# EAGLE design Enclosure 85x58 BCS-A4a (EAGLE 9.6.2)
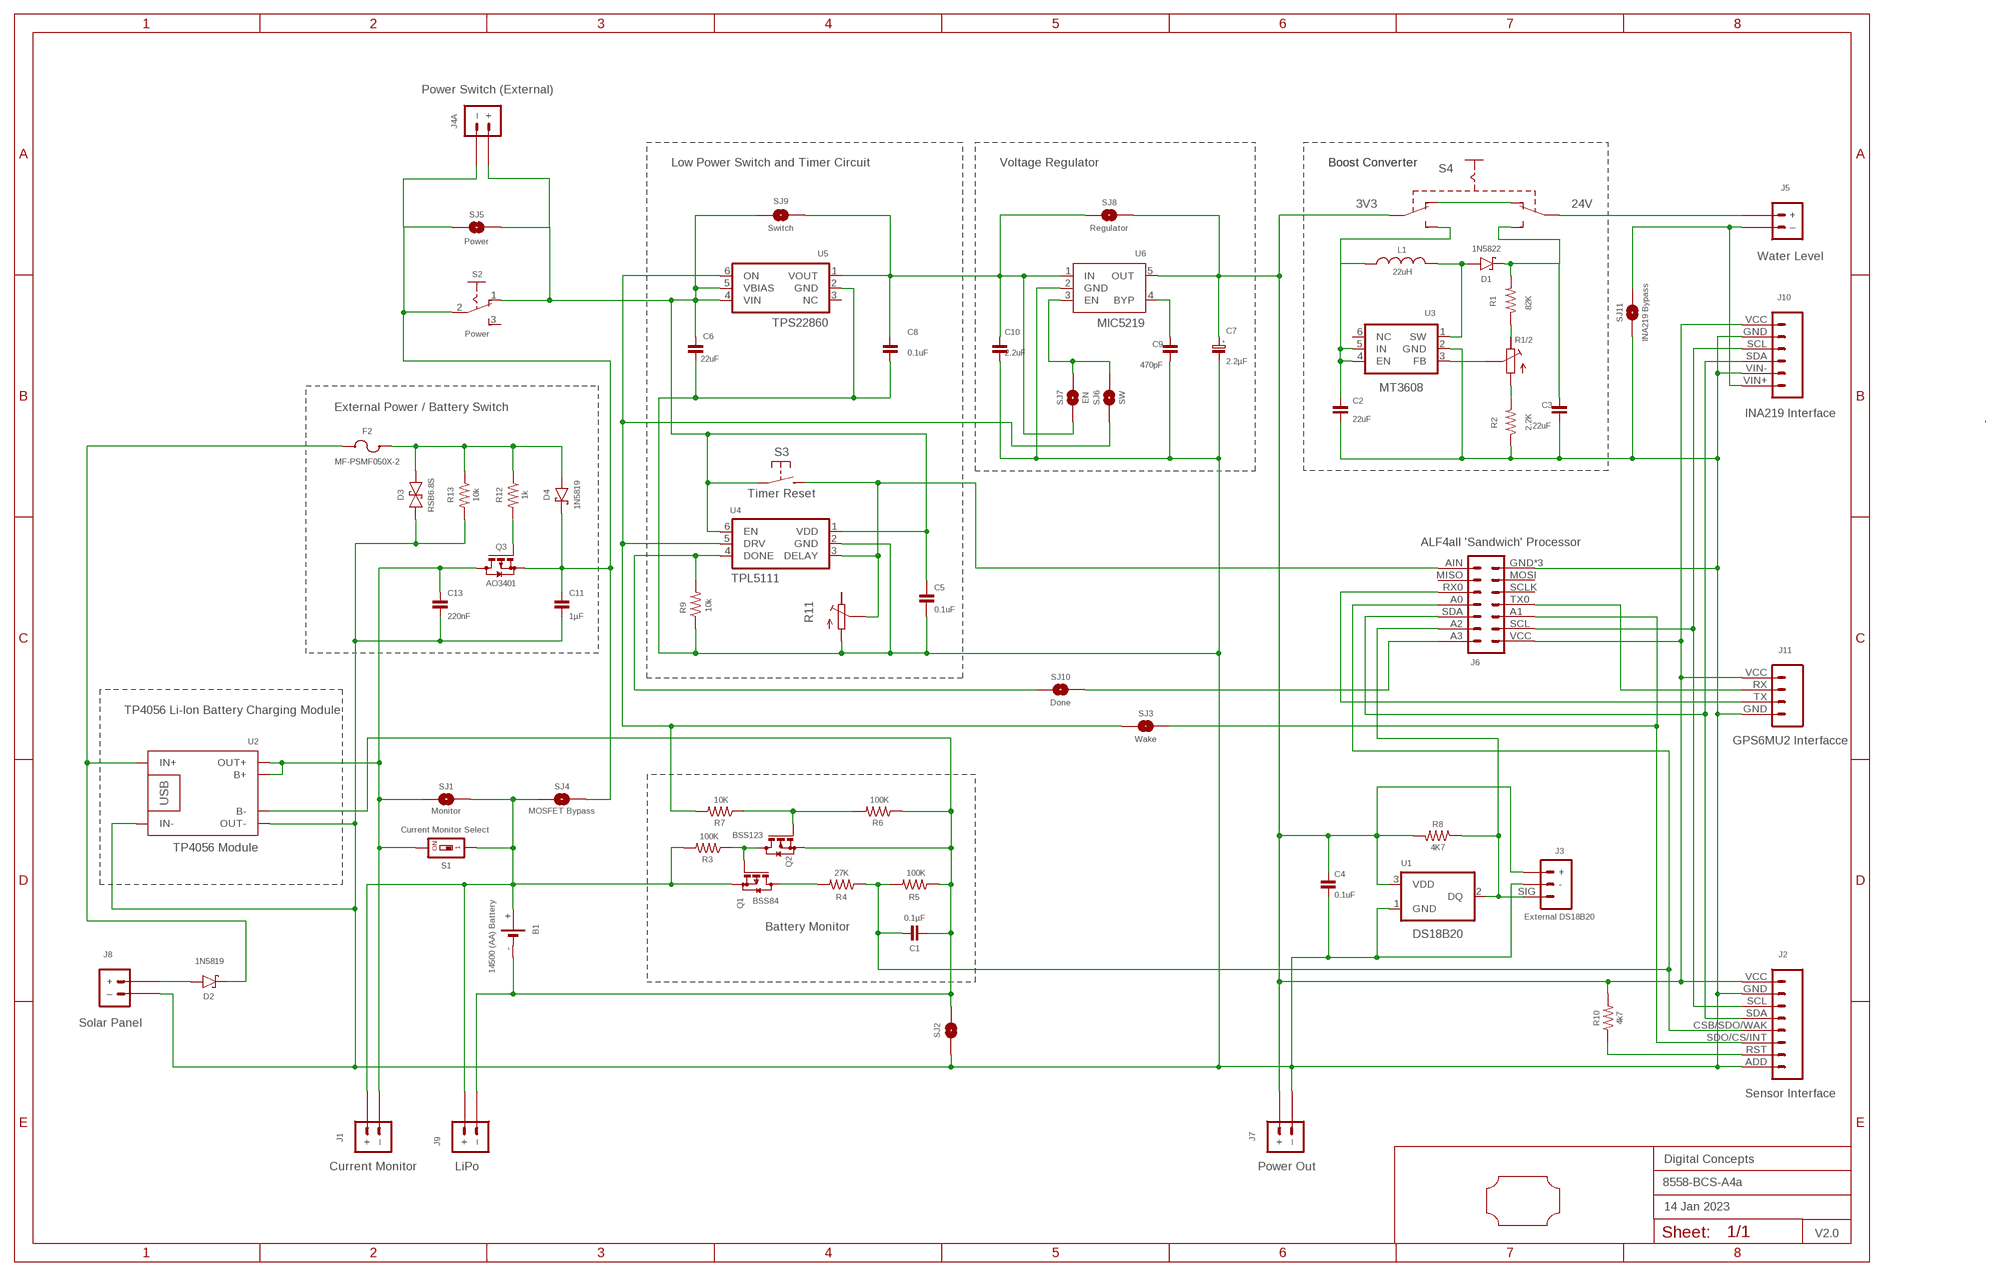
[diagram p0: schematic, sheet 1]
FRAME2 (A3L-LOC): DATE: 14 Jan 2023; OWNER: Digital Concepts; TITLE: 8558-BCS-A4a; VERSION: V2.0

## Parts
B1  14500 (AA) Battery  BATTERY-HOLDER-14500(AA)  [BATTERY-14500]
C1  0.1µF  CAPACITOR-0805  [C0805]
C2  22uF  CAPACITOR-1206  [C1206]
C3  22uF  CAPACITOR-1206  [C1206]
C4  0.1uF  CAPACITOR-0805  [C0805]
C5  0.1uF  CAPACITOR  [C0805@1]
C6  22uF  CAPACITOR-1206  [C1206]
C7  2.2µF  CAPACITOR-1206-TANTALUM  [C1206-POLARISED]
C8  0.1uF  CAPACITOR-0805  [C0805]
C9  470pF  CAPACITOR-0805  [C0805]
C10  2.2uF  CAPACITOR-0805  [C0805]
C11  1µF  CAPACITOR-0805  [C0805]
C13  220nF  CAPACITOR-0805  [C0805]
D1  1N5822  DIODE-SCHOTTKY-1N5822  [DIODE_SMB]
D2  1N5819  1N5819-SOD-123  [SOD-123]
D3  RSB6.8S  DIODE-SCHOTTKY-BIDIRECTIONAL  [VMD2]
D4  1N5819  DIODE-SCHOTTKY-1N5819  [SOD-123]
F2  MF-PSMF050X-2  [F0805]
J1  Current Monitor  JST-PH2.0-2-H-POWER  [JST-PH2.0-2-HORIZONTAL-POWER]
J2  Sensor Interface  HEADER-1X8-SENSOR  [CONN_08-SENSOR]
J3  External DS18B20  JST-PH2.0-3-VERTICAL-SIG  [JST-PH2.0-3-VERTICAL-SIG]
J4A  Power Switch (External)  JST-PH2.0-2-DUAL-POWER"  [JST-PH2.0-2-DUAL-POWER]
J5  Water Level  JST-PH2.0-2-VERTICAL-POWER  [JST-PH2.0-2-VERTICAL-POWER]
J6  ALF4all 'Sandwich' Processor  ALF4ALL-PROCESSOR-BOARD  [ALF4ALL-PROCESSOR-BOARD]
J7  Power Out  JST-GH1.25-2-VERTICAL-POWER  [JST-GH1.25-2-VERTICAL-POWER]
J8  Solar Panel  JST-PH2.0-2-VERTICAL-POWER  [JST-PH2.0-2-VERTICAL-POWER]
J9  LiPo  JST-PH2.0-2-H-POWER  [JST-PH2.0-2-HORIZONTAL-POWER]
J10  INA219 Interface  INA219-I2C-MODULE  [CONN_06-INA219]
J11  GPS6MU2 Interfacce  HEADER-1X4-GPS  [CONN_04-GPS]
L1  22uH  INDUCTOR-CDRH104R/6D28L5038P  [CDRH104R+6D28]
Q1  BSS84  [SOT23]
Q2  BSS123  [SOT23]
Q3  AO3401  MOSFET-AO3401  [SOT-23]
R1  82K  RESISTORR0805  [R0805]
R1/2  RESISTOR-TRIMM-BAOTER-HORIZONTAL  [RTRIM64P]
R2  2.2K  RESISTOR-VIA-1  [R0805-VIA-1]
R3  100K  RESISTORR0805  [R0805]
R4  27K  RESISTORR0805  [R0805]
R5  100K  RESISTORR0805  [R0805]
R6  100K  RESISTORR0805  [R0805]
R7  10K  RESISTORR0805  [R0805]
R8  4K7  RESISTORR0805  [R0805]
R9  10k  RESISTOR-VIA-2  [R0805-VIA-2]
R10  4k7  RESISTORR0805  [R0805]
R11  RESISTOR-TRIMM-BAOTER-HORIZONTAL  [RTRIM64P]
R12  1k  RESISTORR0805  [R0805]
R13  10k  RESISTORR0805  [R0805]
S1  Current Monitor Select  SWITCH-DIP-SWS001-VIA-1  [SMD-001-VIA-1]
S2  Power  SWITCH-SLIDE-SPDT  [SWITCH-SLIDE-SPDT]
S3  Timer Reset  SWITCH-MOMENTARY-2-PIN  [SWITCH-2-PAD]
S4  SWITCH-SLIDE-DPDT-PTH-S  [SWITCH-DPDT-PTH]
SJ1  Monitor  SJ  [SJ]
SJ2  Charge  SJ-V-1  [SJ-VIA-1]
SJ3  Wake  SJ-V-1  [SJ-VIA-1]
SJ4  MOSFET Bypass  SJ  [SJ]
SJ5  Power  SJ-V-1  [SJ-VIA-1]
SJ6  SW  SJ  [SJ]
SJ7  EN  SJ  [SJ]
SJ8  Regulator  SJ  [SJ]
SJ9  Switch  SJ  [SJ]
SJ10  Done  SJ-V-2  [SJ-VIA-2]
SJ11  INA219 Bypass  SJ  [SJ]
U1  DS18B20  [TO-92]
U2  TP4056 Module  BATTERY-CHARGER-LI-PROT  [BATTERY-CHARGER-LI-PROT]
U3  MT3608  [SOT-23-6]
U4  TPL5111  TPL5111DDCR  [SOT-23-6]
U5  TPS22860  [SOT-23-6]
U6  MIC5219  MIC5219XX  [SOT-23-5]
U$1  PCB-OUTLINE-CA-85X58  [PROTO-28X18-OUTLINE-CA]

## Nets
GND: C2.2 C3.2 C4.2 C5.1 C6.2 C7.2(-) C8.1 C9.2 C10.1 C11.2 C13.2 D3.P$2 J2.ADD J2.GND J3.- J6.GND J6.GND@TL J6.GND@TR J7.-(–) J8.-(–) J10.GND J10.VIN- J11.GND R2.1 R2.1@VIA R9.1 R11.1(A) R13.2 SJ2.1 SJ2.1@V SJ11.1 U1.1(GND) U2.IN- U2.OUT- U3.2(GND) U4.2(GND) U5.2(GND) U6.2(GND)
N$1: D2.A J8.+
N$2: C11.1 D4.C J4A.-(–) Q3.2(S) S2.2(P) SJ4.2 SJ5.2
N$3: B1.+ J1.+ J9.+ Q1.2(S) R3.2 S1.1 S1.1@VIA SJ1.2 SJ4.1
N$5: D2.C F2.1 U2.IN+
N$6: D1.A L1.2 U3.1(SW)
N$7: C9.1 U6.4(BYP)
N$8: J2.SCL J6.SCL J10.SCL
N$9: J2.RST R10.1
N$10: C1.1 J2.CSB/SDO/WAK J6.A0 R4.1 R5.2
N$11: J2.SDA J6.SDA J10.SDA
N$13: J3.SIG J6.A2 R8.1 U1.2(DQ)
N$14: J6.TX0 J11.RX
N$15: J5.-(–) J10.VIN+ SJ11.2
N$16: J6.RX0 J11.TX
N$18: C13.1 J1.-(–) Q3.3(D) S1.2 SJ1.1 U2.B+ U2.OUT+
N$19: SJ6.2 SJ7.2 U6.3(EN)
N$20: C8.2 C10.2 SJ7.1 SJ8.1 SJ9.1 U5.1(VOUT) U6.1(IN)
N$22: J6.A3 SJ10.1
N$23: Q1.3(D) R4.2
N$24: C2.1 L1.1 U3.4(EN) U3.5(IN)
N$25: J6.AIN R11.2(S) S3.P$2(S) U4.3(DELAY)
N$27: C5.2 C6.1 J4A.+ S2.1(O) S3.P$1(P) SJ5.1 SJ5.1@V SJ9.2 U4.1(VDD) U4.6(EN) U5.4(VIN) U5.5(VBIAS)
N$28: R7.2 SJ3.2 SJ6.1 U4.5(DRV) U5.6(ON)
N$29: R9.2 R9.2@VIA SJ10.2 SJ10.2@V U4.4(DONE)
N$30: J2.SDO/CS/INT J6.A1 SJ3.1 SJ3.1@V
N$31: C3.1 D1.C R1.2
N$32: R1.1 R1/2.3(E)
N$33: R1/2.2(S) U3.3(FB)
N$34: R1/2.1(A) R2.2
N$35: Q1.1(G) Q2.3(D) R3.1
N$36: S4.P$6(S2)
N$37: Q2.1(G) R6.2 R7.1
N$38: B1.- C1.2 J9.-(–) Q2.2(S) R5.1 R6.1 SJ2.2 U2.B-
N$39: S4.P$1(O1) S4.P$4(O2)
N$41: S4.P$3(S1)
N$42: J5.+ S4.P$5(P2)
N$43: Q3.1(G) R12.2
N$44: D3.P$1 D4.A F2.2 R12.1 R13.1
VCC: C4.1 C7.1(+) J2.VCC J3.+ J6.VCC J7.+ J10.VCC J11.VCC R8.2 R10.2 S4.P$2(P1) SJ8.2 U1.3(VDD) U6.5(OUT)
Unconnected: J6.MISO J6.MOSI J6.SCLK R11.3(E) S2.3(S) U3.6(NC) U5.3(NC)

## Notes on the sheet
- Low Power Switch and Timer Circuit | Voltage Regulator | Boost Converter | Boost Converter
- 3V3 | 24V
- External Power / Battery Switch
- TP4056 Li-Ion Battery Charging Module
- Battery Monitor

## Library data of the parts
B1 = digitalconcepts:BATTERY-HOLDER-14500(AA): 14500 (AA) battery holder
C1 C4 C8-C11 C13 = digitalconcepts:CAPACITOR-0805: 0805 Capacitor
C2 C3 C6 = digitalconcepts:CAPACITOR-1206: 1206 Capacitor
C5 = digitalconcepts:CAPACITOR: 0805 Capacitor
C7 = digitalconcepts:CAPACITOR-1206-TANTALUM: Capacitor 1206 Tantalum
D1 = digitalconcepts:DIODE-SCHOTTKY-1N5822: 1N5822 Schottky Diode SMB
D2 = digitalconcepts:1N5819-SOD-123: 1N5819 Schottky Diode SOD-123
D3 = digitalconcepts:DIODE-SCHOTTKY-BIDIRECTIONAL: Schottky Bidirectional Diode
D4 = digitalconcepts:DIODE-SCHOTTKY-1N5819: 1N5819 Schottky Diode SOD-123
F2 = digitalconcepts:MF-PSMF050X-2: PTC Resettable Fuse 0.5A/6V 500mA SMD
J1 J9 = digitalconcepts:JST-PH2.0-2-H-POWER: JST PH2.0 2P Right Angle Connector with power pin labelling
J2 = digitalconcepts:HEADER-1X8-SENSOR: IoT Sensors 1x8 Pin Header for 'Sandwich' IoT Sensors
J3 = digitalconcepts:JST-PH2.0-3-VERTICAL-SIG: PH2.0 3P Vertical Connector (Sig)
J4A = digitalconcepts:JST-PH2.0-2-DUAL-POWER: PH2.0 2P PTH Dual-Side Connector (Power); PROD_ID: CONN-09863; SKU: PRT-09914
J5 J8 = digitalconcepts:JST-PH2.0-2-VERTICAL-POWER: JST PH2.0 2P PTH Connector (Power)
J6 = digitalconcepts:ALF4ALL-PROCESSOR-BOARD: ALF4all 'Sandwixh' Processor 2x7 Pin Header and earthed 1x1 locator pins for ALF4all 'Sandwich' Processor/RFM95W PCBs
J7 = digitalconcepts:JST-GH1.25-2-VERTICAL-POWER: JST GH1.25 2P PTH Connector (Power)
J10 = digitalconcepts:INA219-I2C-MODULE: INA219 I2C Module
J11 = digitalconcepts:HEADER-1X4-GPS: NEO GPS 4-Pin Header
L1 = digitalconcepts:INDUCTOR-CDRH104R/6D28: Inductor; SPICEPREFIX: L
Q1 = digitalconcepts:BSS84: P-CHANNEL MOS FET
Q2 = digitalconcepts:BSS123: N-CHANNEL MOS FET
Q3 = digitalconcepts:MOSFET-AO3401: AO3401 P-Channel MOSFET
R1 R3-R8 R10 R12 R13 = digitalconcepts:RESISTOR: Resistor; SPICEPREFIX: R
R1/2 R11 = digitalconcepts:RESISTOR-TRIMM-BAOTER-HORIZONTAL: Trimm Resistor - Horizontal BAOTER
R2 = digitalconcepts:RESISTOR-VIA-1: Resistor with via on Pad 1
R9 = digitalconcepts:RESISTOR-VIA-2: Resistor with via on Pad 2
S1 = digitalconcepts:SWITCH-DIP-SWS001-VIA-1: SMD Dip Switch 1 pol.
S2 = digitalconcepts:SWITCH-SLIDE-SPDT: Mini Sliding Switch SPDT
S3 = digitalconcepts:SWITCH-MOMENTARY-2-PIN: 2 Pin Momentary Switch
S4 = digitalconcepts:SWITCH-SLIDE-DPDT-PTH-S: Switch DPDT PTH-S
SJ1 SJ4 SJ6-SJ9 SJ11 = digitalconcepts:SJ: Solder Jumper
SJ2 SJ3 SJ5 = digitalconcepts:SJ-V-1: Solder Jumper with single Pad Via
SJ10 = digitalconcepts:SJ-V-2: Solder Jumper with Pad Vias
U1 = digitalconcepts:DS18B20: Digital Thermometer -55C-125C TO92-3; AVAILABILITY: Bad; DESCRIPTION: Temperature Sensor Digital, Local -55°C ~ 125°C 12 b 8-uMAX; MF: Maxim Integrated; MP: DS18B20; PACKAGE: TO-92 Maxim Integrated; PRICE: None
U2 = digitalconcepts:BATTERY-CHARGER-LI-PROT: TP4056 Li Battery Charger module with PCB (rather than module) footprint
U3 = digitalconcepts:MT3608: MT3608 DC-DC Step-Up Voltage Converter
U4 = digitalconcepts:TPL5111DDCR: TPL5111 Nano-Power System Timer
U5 = digitalconcepts:TPS22860: Texas Instruments TPS22860 Ultra-Low Leakage Load Switch
U6 = digitalconcepts:MIC5219XX: VOLTAGE REGULATOR; OC_FARNELL: unknown; OC_NEWARK: unknown
U$1 = digitalconcepts:PCB-OUTLINE-CA-85X58: PCB outline with cut-out for 85 x 58 enclosure

## Board
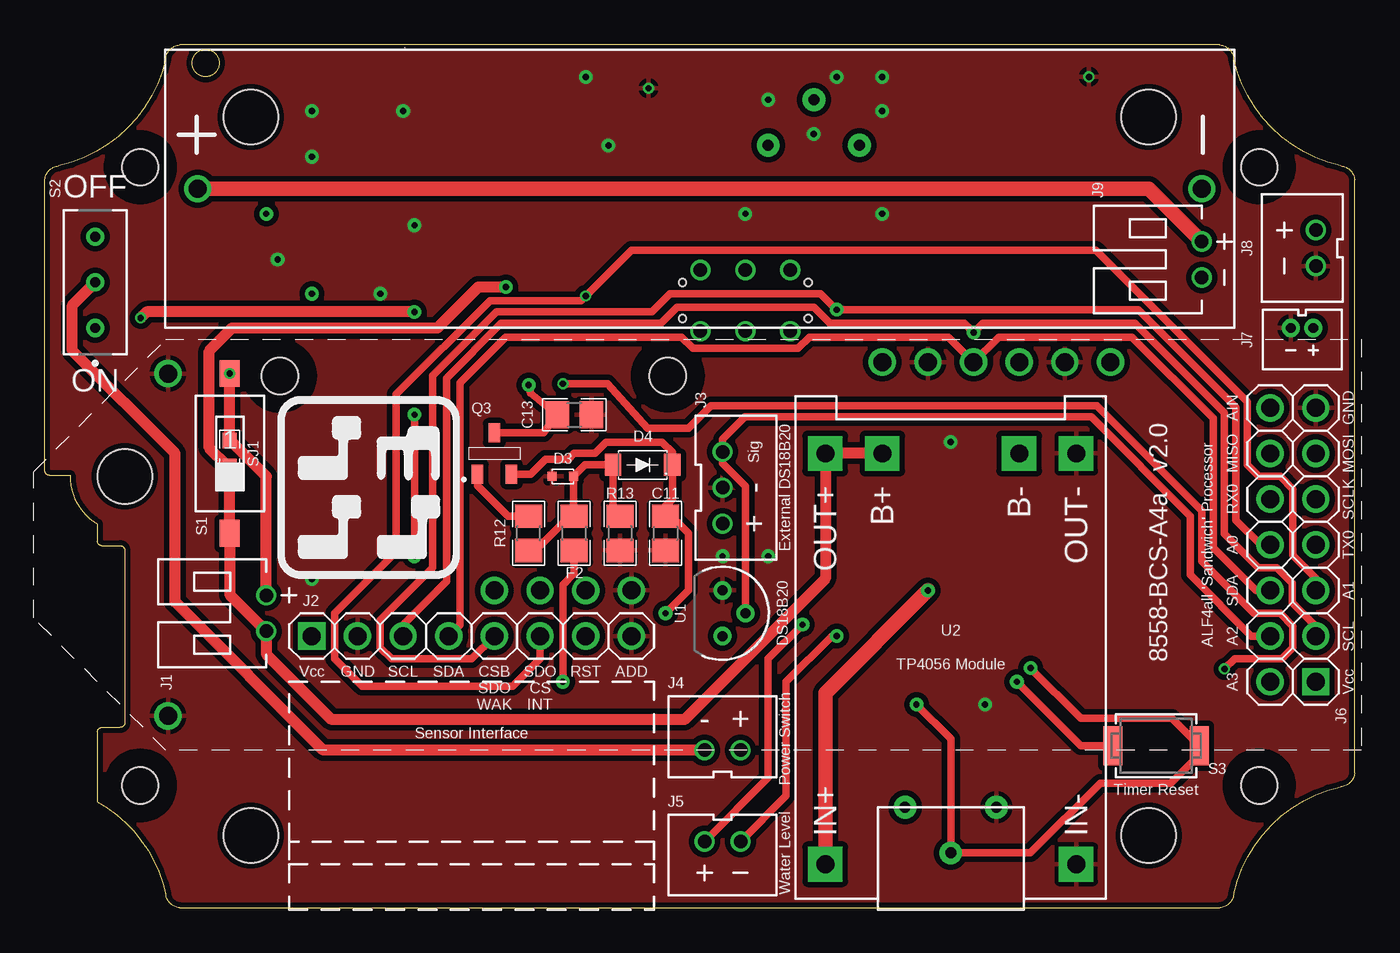
[diagram p1: board, top side]
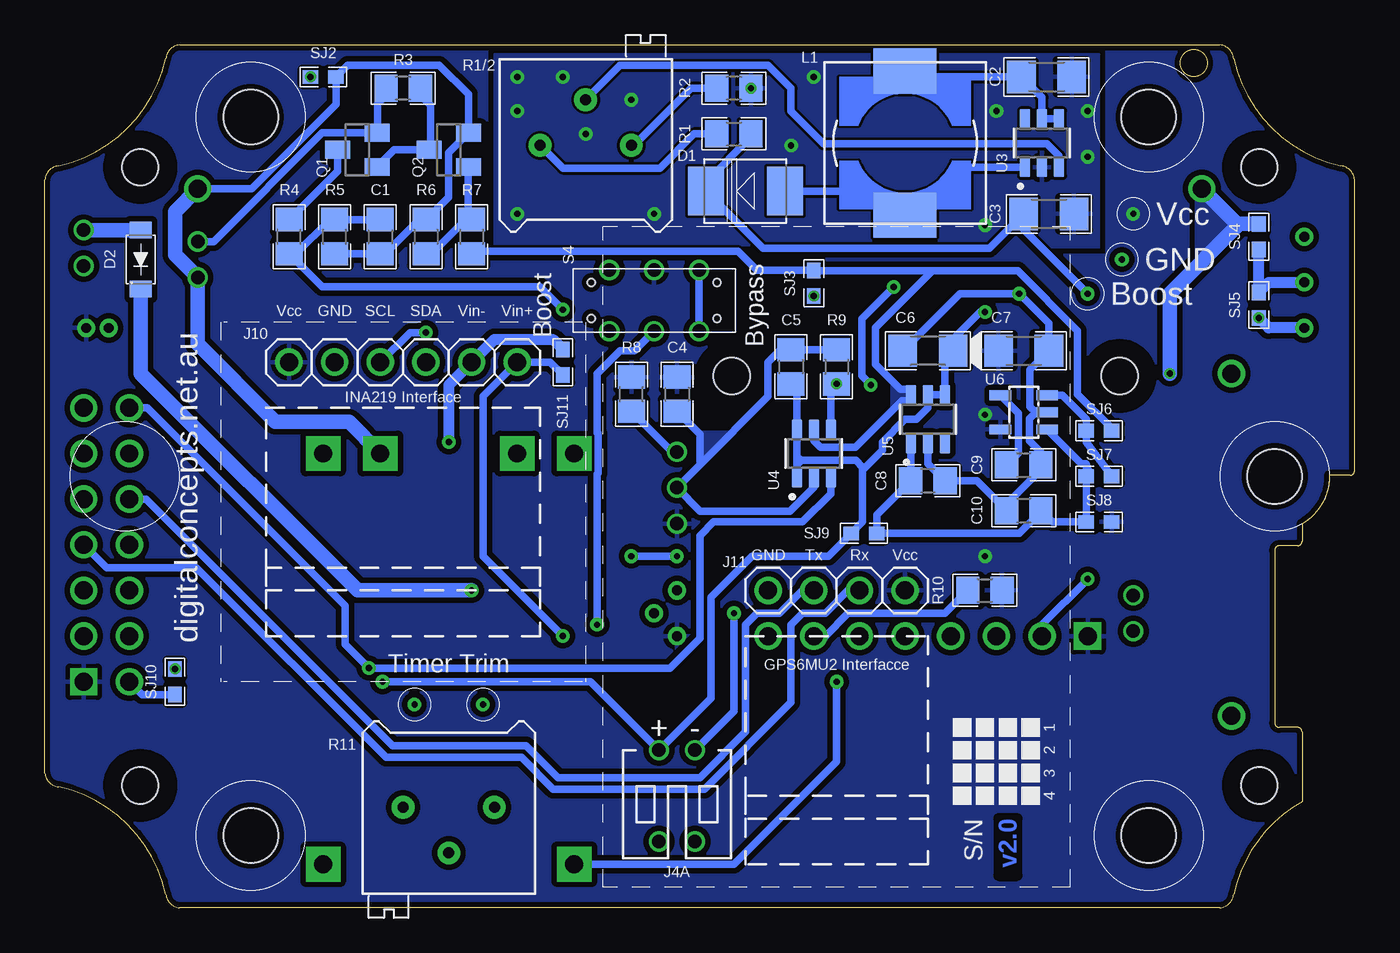
[diagram p2: board, bottom side, seen from below]

Size 72.9 x 48.01 mm. Coordinates in mm from the lower left corner, seen from the top.
Copper layers (1*16): Top 0.035mm / dielectric 1.5mm / Bottom 0.035mm
Design rules "default *": minimum track width 6mil, minimum drill 0.35mm, track to track 6mil, track to pad 6mil, pad to pad 6mil, via to via 6mil, smd to smd 6mil, copper to edge 6mil, drill to drill 6mil, minimum pad ring 1mil, minimum via ring 8mil, stop-mask expansion 4mil, vias tented up to drill 0mil, thermal gap 10mil
Holes 2.03 mm at 13.08,29.59 34.67,29.59

### Footprints (pad centres in the part's own frame; a part is rotated, then mirrored left to right if it is on the bottom)
BATTERY-14500 = drill 1: + -27.94,0; - 27.94,0
C0805 = smd 1.3 x 1.5: 1 -0.95,0; 2 0.95,0
C1206 = smd 1.6 x 1.8: 1 -1.4,0; 2 1.4,0
C0805@1 = smd 1.3 x 1.5: 1 -0.95,0; 2 0.95,0
C1206-POLARISED = smd 1.6 x 1.8: 1 -1.4,0; 2 1.4,0
DIODE_SMB = smd 2 x 2.7: A 2.2,0; C -2.2,0
SOD-123 = smd 0.91 x 1.22: A -1.65,0; C 1.65,0
VMD2 = smd 0.5 x 0.5: P$1 -0.6,0; P$2 0.6,0
F0805 = smd 1.3 x 1.5: 1 -0.95,0; 2 0.95,0
JST-PH2.0-2-HORIZONTAL-POWER = drill 0.75: + 1,0; - -1,0
CONN_08-SENSOR = drill 1 pad 1.524: ADD 17.78,0; CSB/SDO/WAK 10.16,0; GND 2.54,0; RST 15.24,0; SCL 5.08,0; SDA 7.62,0; SDO/CS/INT 12.7,0 | drill 1 pad 1.524 square: VCC 0,0
JST-PH2.0-3-VERTICAL-SIG = drill 0.75: + -2,0; - 0,0; SIG 2,0
JST-PH2.0-2-DUAL-POWER = drill 0.75: + 1,0; - -1,0
JST-PH2.0-2-VERTICAL-POWER = drill 0.75: + -1,0; - 1,0
ALF4ALL-PROCESSOR-BOARD = drill 1 pad 1.524: A0 7.62,2.54; A1 5.08,0; A2 2.54,2.54; A3 0,2.54; AIN 15.24,2.54; GND 15.24,0; GND@TL -1.905,63.881; GND@TR 17.145,63.881; MISO 12.7,2.54; MOSI 12.7,0; RX0 10.16,2.54; SCL 2.54,0; SCLK 10.16,0; SDA 5.08,2.54; TX0 7.62,0 | drill 1 pad 1.524 square: VCC 0,0
JST-GH1.25-2-VERTICAL-POWER = drill 0.55 pad 1.016: + 0.625,0; - -0.625,0
CONN_06-INA219 = drill 1 pad 1.524: GND 2.54,0; SCL 5.08,0; SDA 7.62,0; VCC 0,0; VIN+ 12.7,0; VIN- 10.16,0
CONN_04-GPS = drill 1 pad 1.524: GND 0,0; RX 5.08,0; TX 2.54,0; VCC 7.62,0
CDRH104R+6D28 = smd 2.5 x 3.5: 1 -4,0; 2 4,0
SOT23 = smd 1 x 1.4: 1 -0.95,-1.1; 2 0.95,-1.1; 3 0,1.1
SOT-23 = smd 0.65 x 1.05: 1 -0.95,-1.15; 2 0.95,-1.15; 3 0,1.15
R0805 = smd 1.3 x 1.5: 1 -0.95,0; 2 0.95,0
RTRIM64P = drill 0.61 pad 1.27: 1 0,-2.54; 2 2.54,0; 3 0,2.54
R0805-VIA-1 = smd 1.3 x 1.5: 1 -0.95,0; 2 0.95,0 | drill 0.35 pad 0.61: 1@VIA -0.95,0
R0805-VIA-2 = smd 1.3 x 1.5: 1 -0.95,0; 2 0.95,0 | drill 0.35 pad 0.61: 2@VIA 0.95,0
SMD-001-VIA-1 = smd 1.1 x 1.5: 1 0,-4.45; 2 0,4.45 | drill 0.35 pad 0.61: 1@VIA 0,-4.45
SWITCH-SLIDE-SPDT = drill 0.55 pad 1.016: 1 -2.54,0; 2 0,0; 3 2.54,0
SWITCH-2-PAD = smd 1.067 x 2.184: P$1 -2.4,0; P$2 2.4,0
SWITCH-DPDT-PTH = drill 0.75: P$1 -1.7,2.5; P$2 -1.7,0; P$3 -1.7,-2.5; P$4 1.7,2.5; P$5 1.7,0; P$6 1.7,-2.5 | hole 0.42: 1,3.5; -1,3.5; 1,-3.5; -1,-3.5
SJ = smd 0.864 x 0.762: 1 -0.711,0; 2 0.711,0
SJ-VIA-1 = smd 0.864 x 0.762: 1 -0.711,0; 2 0.711,0 | drill 0.35 pad 0.61: 1@V -0.711,0
SJ-VIA-2 = smd 0.864 x 0.762: 1 -0.711,0; 2 0.711,0 | drill 0.35 pad 0.61: 2@V 0.711,0
TO-92 = drill 0.55 pad 1.016: 1 -1.27,0; 2 0,1.27; 3 1.27,0
BATTERY-CHARGER-LI-PROT = drill 1 pad 1.93 square: B+ 10.795,3.81; B- 10.795,-3.81; IN+ -12.065,6.985; IN- -12.065,-6.985; OUT+ 10.795,6.985; OUT- 10.795,-6.985
SOT-23-6 = smd 1.1 x 0.6: 1 -1.35,0.95; 2 -1.35,0; 3 -1.35,-0.95; 4 1.35,-0.95; 5 1.35,0; 6 1.35,0.95
SOT-23-5 = smd 0.55 x 1.2: 1 -0.95,-1.3; 2 0,-1.3; 3 0.95,-1.3; 4 0.95,1.3; 5 -0.95,1.3
PROTO-28X18-OUTLINE-CA = hole 2.032: -31.14,17.196; -31.14,-17.196; 31.14,-17.196; 31.14,17.196 | hole 3.048: -24.994,19.99; -32.004,0; -24.994,-19.99; 24.994,-19.99; 24.994,19.99

### Placement (x,y rotation side)
B1  36.45,40.01 0 top
C1  54.23,37.34 270 bottom
C2  17.14,46.23 0 bottom
C3  17.02,38.61 0 bottom
C4  37.72,28.58 270 bottom
C5  31.37,30.1 270 bottom
C6  23.75,30.99 180 bottom
C7  18.41,30.99 0 bottom
C8  23.75,23.75 180 bottom
C9  18.41,24.64 0 bottom
C10  18.41,22.1 0 bottom
C11  34.54,20.83 270 top
C13  29.46,27.43 0 top
D1  33.91,39.88 0 bottom
D2  67.56,36.07 270 bottom
D3  28.83,24 180 top
D4  33.27,24.64 0 top
F2  29.46,20.83 90 top
J1  12.32,16.38 90 top
J2  14.86,15.11 0 top
J3  37.72,23.37 90 top
J4A  37.72,8.76 180 bottom
J5  37.72,3.68 0 top
J6  70.74,12.57 90 top
J7  69.98,32.26 0 top
J8  70.74,36.7 270 top
J9  64.39,36.07 90 top
J10  59.31,30.35 0 bottom
J11  32.64,17.65 0 bottom
L1  25.02,42.55 270 bottom
Q1  55.5,42.16 90 bottom
Q2  50.42,42.16 90 bottom
Q3  25.02,25.27 0 top
R1  34.54,43.05 0 bottom
R1/2  42.8,42.42 90 bottom
R2  34.54,45.59 180 bottom
R3  52.96,45.59 180 bottom
R4  59.31,37.34 90 bottom
R5  56.77,37.34 90 bottom
R6  51.69,37.34 270 bottom
R7  49.15,37.34 270 bottom
R8  40.26,28.58 90 bottom
R9  28.83,30.1 270 bottom
R10  20.57,17.65 0 bottom
R11  50.42,5.59 270 bottom
R12  26.92,20.83 90 top
R13  32,20.83 270 top
S1  10.29,25.27 180 top
S2  2.79,34.8 90 top
S3  61.85,9.02 0 top
S4  38.99,33.78 270 bottom
SJ1  10.29,25.27 90 top
SJ2  57.4,46.23 0 bottom
SJ3  30.1,34.75 90 bottom
SJ4  5.33,37.34 270 bottom
SJ5  5.33,33.53 90 bottom
SJ6  14.22,26.54 180 bottom
SJ7  14.22,24 0 bottom
SJ8  14.22,21.46 0 bottom
SJ9  27.3,20.83 180 bottom
SJ10  65.66,12.57 90 bottom
SJ11  44.07,30.35 270 bottom
U1  37.72,16.38 270 top
U2  50.42,14.48 90 top
U3  17.4,42.55 90 bottom
U4  30.1,25.27 90 bottom
U5  23.75,27.18 90 bottom
U6  18.41,27.56 90 bottom
U$1  36.45,24 0 top

### Tracks (layer width: path | path; a pad name or v marks a point on that pad's centre or on a via)
$X1
  cutout Bottom: 67.59,43.23 arc180 67.59,39.17 arc180
$X2
  cutout Bottom: 67.59,8.84 arc180 67.59,4.78 arc180
$X3
  cutout Bottom: 5.31,8.84 arc180 5.31,4.78 arc180
$X4
  cutout Top: 5.31,43.23 arc180 5.31,39.17 arc180
$X5
  cutout Bottom: 5.31,43.23 arc180 5.31,39.17 arc180
$X6
  cutout Top: 67.59,43.23 arc180 67.59,39.17 arc180
$X7
  cutout Top: 67.59,8.84 arc180 67.59,4.78 arc180
$X8
  cutout Top: 5.31,8.84 arc180 5.31,4.78 arc180
$X9
  cutout Bottom: 13.08,31.62 arc180 13.08,27.56 arc180
$X10
  cutout Top: 13.08,31.62 arc180 13.08,27.56 arc180
$X11
  cutout Bottom: 34.67,31.62 arc180 34.67,27.56 arc180
GND  (via drill 0.35)
  Bottom 0.406: R9.1 C5.1 31.94,31.05 32.64,30.35 32.64,28.45 36.45,24.64 | U4.2 30.1,23.4 31.43,22.07 36.42,22.07 J3.- 36.45,24.64 | 17.75,27.56 18.1,27.2 18.1,25.98 17.46,25.34 C9.2 17.46,24.38 19.36,22.48 C10.1 21.02,23.75 C8.1 23.69,24.64 23.69,24.65 23.75,24.7 U5.2 | U6.2 17.75,27.56 | C4.2 36.45,26.36 36.45,24.64 | 17.75,27.56 18.07,27.88 18.07,29.93 C7.2 17.01,32.51 v18.67,34.16 21.97,34.16 C6.2 | v14.86,18.29 17.4,15.75 J2.GND | v37.72,19.56 v40.26,19.56
  Bottom 0.61: SJ11.1 44.63,31.62 47.88,31.62 J10.VIN- 50.42,29.08 v50.42,25.91
  other vias: 46.61,38.61 14.86,41.78 30.1,46.23 20.57,37.97 46.61,44.32 46.61,46.23 12.95,36.07 52.32,11.3 14.86,44.32 19.94,44.32 31.37,42.42 38.99,38.61 44.07,46.23 40.26,44.96 42.8,43.05
  pour Top (isolate 0.305): -2.08,49.93 -2.08,-1.97 74.92,-1.97 74.92,49.93
  pour Bottom: 47.88,47.5 47.88,36.92 14.22,36.73 14.22,47.5
  pour Bottom: 36.45,24.64 36.45,26.36 34.74,26.36
N$1
  Bottom 0.813: D2.A 67.58,37.7 J8.+
N$2  (via drill 0.35)
  Top 0.406: Q3.2 27.04,24.12 27.88,24.96 29.15,24.96 29.46,25.27 30.61,25.27 31.24,25.91 34.35,25.91 34.92,25.34 D4.C 34.92,22.73 34.54,22.35 C11.1 34.86,21.78 35.81,20.83 35.81,17.65 v34.54,16.38
  Top 0.61: S2.2 1.52,33.53 1.52,30.99 7.24,25.27 7.24,17.02 15.49,8.76 J4A.-
  Bottom 0.406: J4A.- 34.54,10.94 v34.54,16.38
  Bottom 0.61: S2.2 4.77,34.8 SJ5.2 SJ4.2
N$3
  Top 0.61: J1.+ 12.32,24 10.34,25.98 SJ1.2 S1.1
  Top 0.813: J9.+ 61.45,40.01 B1.+
  Bottom 0.406: R3.2 53.91,45.19 54.37,44.73 54.37,43.15 Q1.2 57.47,43.11 63.52,37.07 J9.+
  Bottom 0.813: S1.1 10.29,34.17 6.4,38.05 SJ4.1 6.6,38.05 6.58,38.08 B1.+
  pour Bottom: 8.51,39.88 6.6,37.97 8.51,36.07
N$5  (via drill 0.35)
  Top 0.406: F2.1 29.46,18.61 28.83,17.97 v28.83,12.57
  Top 0.813: U2.IN+ 43.43,11.94 v49.15,17.65
  Bottom 0.406: v28.83,12.57 28.83,8.13 34.54,2.41 U2.IN+
  Bottom 0.813: D2.C 67.56,29.72 55.5,17.65 v49.15,17.65
N$6
  Bottom 0.406: D1.A 26.99,39.88 25.65,38.55 L1.2 24.38,38.55 21.73,41.2 U3.1
N$7
  Bottom 0.406: U6.4 18.72,27.52 18.72,25.28 C9.1
N$8  (via drill 0.35)
  Top 0.406: J6.SCL 70.74,15.67 69.44,16.97 69.44,18.06 68.58,18.92 67.54,18.92 65.66,20.8 65.66,27.53 60.68,32.51 52.2,32.51 v51.69,32 51.18,32.51 43.69,32.51 42.8,33.4 35.18,33.4 34.29,32.51 25.4,32.51 22.35,29.46 22.35,18.16 19.94,15.75 J2.SCL
  Bottom 0.406: v51.69,32 52.58,32 J10.SCL
N$9
  Bottom 0.406: J2.RST 29.46,15.11 28.19,16.38 22.79,16.38 R10.1
N$10  (via drill 0.35)
  Top 0.406: J2.CSB/SDO/WAK 23.75,13.84 19.3,13.84 18.67,14.48 18.67,16 21.59,18.92 21.59,29.59 25.15,33.15 33.78,33.15 34.8,34.16 43.18,34.16 v44.07,33.27 60.86,33.27 66.29,27.84 66.29,21.57 67.67,20.19 J6.A0
  Bottom 0.406: v44.07,33.27 45.34,34.54 57.47,34.54 R4.1 58.93,36.39 57.03,38.29 R5.2 C1.1
N$11
  Top 0.406: J6.SDA 67.41,17.65 65.02,20.04 65.02,27.23 60.5,31.75 53.09,31.75 J10.SDA 50.29,31.75 42.54,31.75 41.91,31.12 36.07,31.12 35.43,31.75 25.65,31.75 23.11,29.21 23.11,15.75 J2.SDA
N$13
  Top 0.406: J6.A2 67.16,15.11 63.75,18.52 63.75,21.79 58.24,27.3 38.96,27.3 37.72,26.07 J3.SIG 37.72,24.73 38.99,23.46 U1.2
  Bottom 0.406: J3.SIG 38,25.37 R8.1
N$14
  Bottom 0.406: J11.RX 28.19,17.65 29.46,16.38 30.73,16.38 31.37,15.75 31.37,11.43 36.2,6.6 44.6,6.6 46.38,8.38 53.9,8.38 64.48,18.92 69.47,18.92 J6.TX0
N$15  (via drill 0.35)
  Top 0.406: v44.07,15.11 43.8,15.11 41.26,12.57 41.26,6.22 J5.-
  Bottom 0.406: SJ11.2 44.78,30.35 J10.VIN+ 48.51,28.45 48.51,19.56 v44.07,15.11
N$16
  Bottom 0.406: J6.RX0 67.26,22.73 53.54,9.02 46.13,9.02 44.35,7.24 36.45,7.24 33.91,9.78 33.91,15.75 33.27,16.38 32,16.38 30.73,17.65 J11.TX
N$18  (via drill 0.35)
  Top 0.406: Q3.3 27.76,26.42 C13.1 27.03,28.62 v26.92,29.08
  Top 0.61: U2.B+ U2.OUT+ 43.43,18.31 35.59,10.47 15.97,10.47 12.32,14.11 J1.- 10.29,17.41 S1.2 SJ1.1 10.16,24.56 9.14,25.58 9.14,30.99 10.41,32.26 21.84,32.26 24.13,34.54 v25.65,34.54
  Bottom 0.406: v26.92,29.08 27.43,29.59 27.43,32.77 v25.65,34.54
N$19
  Bottom 0.406: SJ7.2 14.93,25.91 SJ6.2 14.93,27.18 16.27,28.51 U6.3
N$20
  Bottom 0.406: U6.1 15.21,24.7 14.96,24.7 | SJ7.1 14.74,24.2 14.96,24.7 | 14.96,24.7 14.93,24.67 SJ8.1 16.83,21.46 C10.2 17.46,22.03 18.67,20.83 SJ9.1 26.59,21.85 C8.2 U5.1
N$22
  Bottom 0.406: J6.A3 67.49,11.86 SJ10.1
N$23
  Bottom 0.406: Q1.3 56.62,41.77 56.62,40.98 R4.2
N$24
  Bottom 0.406: U3.4 U3.5 17.4,45.08 C2.1 | L1.1 24.7,46.23 C2.1 | C2.1
N$25  (via drill 0.35)
  Top 0.406: v54.86,13.34 57.66,10.54 62.72,10.54 S3.P$2 64.25,8.51 62.67,6.93 58.75,6.93 54.86,3.05 R11.2 50.42,9.4 v48.51,11.3
  Bottom 0.406: U4.3 29.15,23.03 30.72,21.46 35.69,21.46 36.45,20.7 36.45,14.99 38.1,13.34 v54.86,13.34 56.19,14.66 56.19,16.79 67.21,27.81 J6.AIN
N$26
  pour Bottom: 27.3,24.43 27.76,24.89 26.85,24.89
N$27  (via drill 0.35)
  Top 0.406: S3.P$1 57.66,9.02 v54.1,12.57
  Top 0.61: v20.57,33.15 5.66,33.15 SJ5.1@V
  Bottom 0.406: 31.05,25.15 U4.6 31.05,28.83 C5.2 | 31.05,25.15 U4.1 31.05,24.64 30.89,24.8 | 30.89,24.8 30.79,24.89 27.76,24.89 27.38,24.51 | v54.1,12.57 42.53,12.57 J4A.+ 35.81,11.67 35.81,17.27 33.53,19.56 29.29,19.56 SJ9.2 27.38,21.46 27.38,24.51 | 27.38,24.51 27.3,24.44 26.29,25.45 26.29,25.91 25.02,27.18 24.38,27.18 23.75,27.81 U5.5 U5.4 22.8,30.54 C6.1 22.35,31.62 20.82,33.15 v20.57,33.15 | 30.89,24.8 30.89,24.99 31.05,25.15
  Bottom 0.61: SJ5.1@V 4.77,32.26 S2.1
N$28
  Bottom 0.406: U4.5 30.1,25.99 29.74,25.63 27.77,25.63 25.21,28.2 24.7,28.2 U5.6 24.7,28.86 25.28,28.86 26.67,30.25 26.67,32.26 23.49,35.43 | R7.2 49.02,36.52 34.33,36.52 33.27,35.46 SJ3.2 30.1,35.43 23.49,35.43 | SJ6.1 13.51,26.67 15.42,28.58 15.42,32.11 18.74,35.43 23.49,35.43
  pour Bottom: 24.93,28.49 25.65,29.21 25.65,27.76
N$29
  Top 0.406: R9.2@VIA 31.3,29.15 33.53,26.67 35.81,26.67 37.08,27.94 58.55,27.94 64.39,22.1 64.39,19.28 67.28,16.38 68.76,16.38 69.47,15.67 69.47,14.45 68.86,13.84 66.22,13.84 SJ10.2@V
  Bottom 0.406: R9.2@VIA 29.15,28.83 U4.4
N$30
  Top 0.406: J6.A1 70.74,18.34 69.47,19.61 69.47,23.29 68.76,24 67.56,24 66.93,24.64 66.93,28.14 58.5,36.58 32.64,36.58 SJ3.1@V 29.84,33.78 24.76,33.78 19.56,28.58 19.56,19.81 16.13,16.38 16.13,13.84 17.65,12.32 26.03,12.32 27.56,13.84 J2.SDO/CS/INT
N$31  (via drill 0.35)
  Bottom 0.406: R1.2 33.59,42.89 36.11,40.38 D1.C 32.93,36.7 20.32,36.7 C3.1 18.42,37.72 v14.86,34.16
N$32
  Bottom 0.406: R1/2.3 44.07,41.15 38.67,41.15 36.76,43.05 R1.1
N$33
  Bottom 0.406: R1/2.2 40.89,46.86 32.64,46.86 31.37,45.59 31.37,44.32 29.55,42.5 17.12,42.5 16.45,41.83 U3.3
N$34
  Bottom 0.406: R2.2 36.93,45.59 40.1,42.42 R1/2.1
N$35
  Bottom 0.406: R3.1 52.01,45.21 51.44,44.65 51.44,42.24 Q2.3 53.45,42.16 Q1.1
N$37
  Bottom 0.406: R6.2 51.37,36.39 49.47,38.29 R7.1 49.35,38.49 49.35,41.18 Q2.1
N$38
  Bottom 0.406: B1.- 61.39,40.01 56.69,44.7 SJ2.2 56.06,46.86 50.95,46.86 49.32,45.25 Q2.2 50.43,42 50.43,39.54 R6.1 52.07,38.29 53.97,36.39 C1.2 R5.1
  Bottom 0.813: U2.B- 55.97,27.05 60.07,27.05 64.39,31.37 J9.- 65.66,36.34 65.66,38.73 B1.-
N$39
  Bottom 0.406: S4.P$1 S4.P$4
N$42  (via drill 0.35)
  Top 0.406: J5.+ 40.26,7.22 40.26,13.84 v42.16,15.75
  Bottom 0.406: S4.P$5 40.08,30.99 40.89,30.99 42.16,29.72 42.16,26.44 42.11,26.39 42.11,24.16 42.16,24.11 v42.16,15.75
N$43
  Top 0.406: R12.2 25.78,21.78 24.07,23.49 Q3.1
N$44
  Top 0.406: R12.1 27.3,19.88 28.95,21.52 29.2,21.52 F2.2 29.43,21.78 D3.P$1 30.06,24.64 D4.A 31.62,22.16 R13.1
VCC  (via drill 0.35)
  Top 0.406: v20.57,27.43 v20.57,19.56
  other vias: 12.32,38.61
  pour Bottom (isolate 0.305, rank 2): -1.08,48.93 -1.08,-0.97 73.92,-0.97 73.92,48.93
X$1
  cutout Bottom: 13.08,31.62 arc-180 13.08,27.56 arc-180
X$2
  cutout Top: 13.08,31.62 arc-180 13.08,27.56 arc-180
X$3
  cutout Top: 34.67,31.62 arc-180 34.67,27.56 arc-180
X$4
  cutout Bottom: 34.67,31.62 arc-180 34.67,27.56 arc-180

### Text on the board
Bottom: v2.0
tPlace: OFF | ON | AIN | GND | MISO | MOSI | RX0 | SCLK | 8558-BCS-A4a v2.0 | A0 | TX0 | SDA | A1 | A2 | SCL | Vcc | GND | SCL | SDA | RST | ADD | A3 | Vcc | CSB / SDO / WAK | SDO / CS / INT
bPlace: Vcc | GND | Boost | Vin+ | Vin- | SDA | SCL | GND | Vcc | digitalconcepts.net.au | Vcc | Rx | Tx | GND | Timer Trim | 1 | 2 | 3 | 4 | S/N
tNames: TP4056 Module | J4 | Power Switch
bNames: Bypass | Boost